# Altium schematic sheet SCH-Connector.SchDoc
size A4
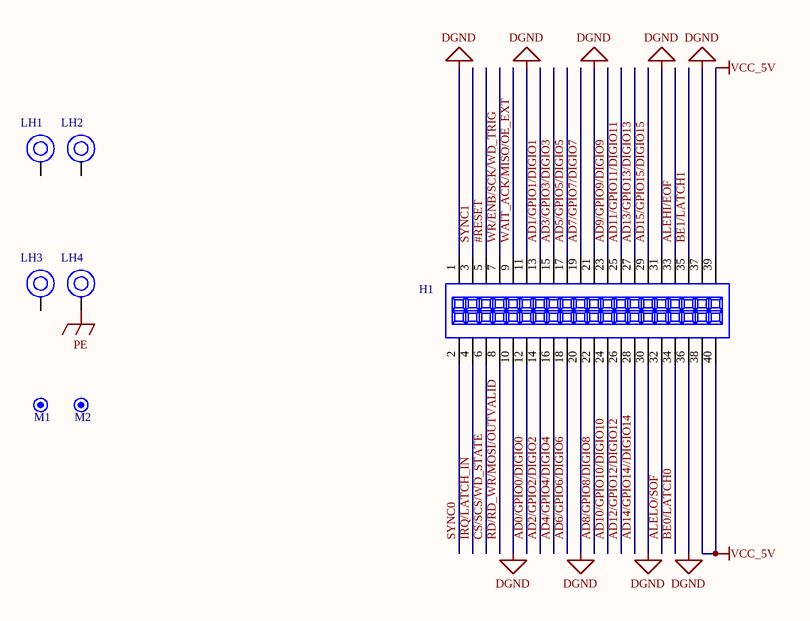
[diagram p0: SCH-Connector.SchDoc]

## Parts
H1  直插双排母2.4/4.3  [2.00 mm 直插双排母2.4/4.3 2X20P]  (value not drawn)
LH1  DPDT/24V/250VAC/30A  [LOCAL-HOLE-M3/5]  (value not drawn)  (no BOM)
LH2  DPDT/24V/250VAC/30A  [LOCAL-HOLE-M3/5]  (value not drawn)  (no BOM)
LH3  DPDT/24V/250VAC/30A  [LOCAL-HOLE-M3/5]  (value not drawn)  (no BOM)
LH4  DPDT/24V/250VAC/30A  [LOCAL-HOLE-M3/5]  (value not drawn)  (no BOM)
M1  MARK POINT  [MARK-POINT-1mm/2mm]  (value not drawn)  (no BOM)
M2  MARK POINT  [MARK-POINT-1mm/2mm]  (value not drawn)  (no BOM)

## Nets
DGND: H1.1 H1.10 H1.11 H1.20 H1.21 H1.30 H1.31 H1.36 H1.37
PE: LH4.0
VCC_5V: H1.38 H1.39 H1.40
#RESET: H1.5
AD0/GPIO0/DIGIO0: H1.12
AD1/GPIO1/DIGIO1: H1.13
AD2/GPIO2/DIGIO2: H1.14
AD3/GPIO3/DIGIO3: H1.15
AD4/GPIO4/DIGIO4: H1.16
AD5/GPIO5/DIGIO5: H1.17
AD6/GPIO6/DIGIO6: H1.18
AD7/GPIO7/DIGIO7: H1.19
AD8/GPIO8/DIGIO8: H1.22
AD9/GPIO9/DIGIO9: H1.23
AD10/GPIO10/DIGIO10: H1.24
AD11/GPIO11/DIGIO11: H1.25
AD12/GPIO12/DIGIO12: H1.26
AD13/GPIO13/DIGIO13: H1.27
AD14/GPIO14//DIGIO14: H1.28
AD15/GPIO15/DIGIO15: H1.29
ALEHI/EOF: H1.33
ALELO/SOF: H1.32
BE0/LATCH0: H1.34
BE1/LATCH1: H1.35
CS/SCS/WD_STATE: H1.6
IRQ/LATCH_IN: H1.4
RD/RD_WR/MOSI/OUTVALID: H1.8
SYNC0: H1.2
SYNC1: H1.3
WAIT_ACK/MISO/OE_EXT: H1.9
WR/ENB/SCK/WD_TRIG: H1.7

Not connected (* = marked no-connect by the designer): LH1 0; LH2 0; LH3 0

## Library data of the parts
H1 = HDR2.00mm/2x20/F: 2.00 mm 直插双排母 2.4/4.3 2X20P,2A; 1st Manufacturer: MECT; 1st PartNumber: 703-2S-3C-2*20PS-4.3/2.4; 2nd Manufacturer: 国产可替代; ERP_ID: 15C50144; 2nd PartNumber: 国产可替代
LH1-LH4 = LOCAL-HOLE: 定位孔
M1 M2 = MARK POINT: Mark点